# EAGLE design control_wdm (EAGLE 7.4.0)
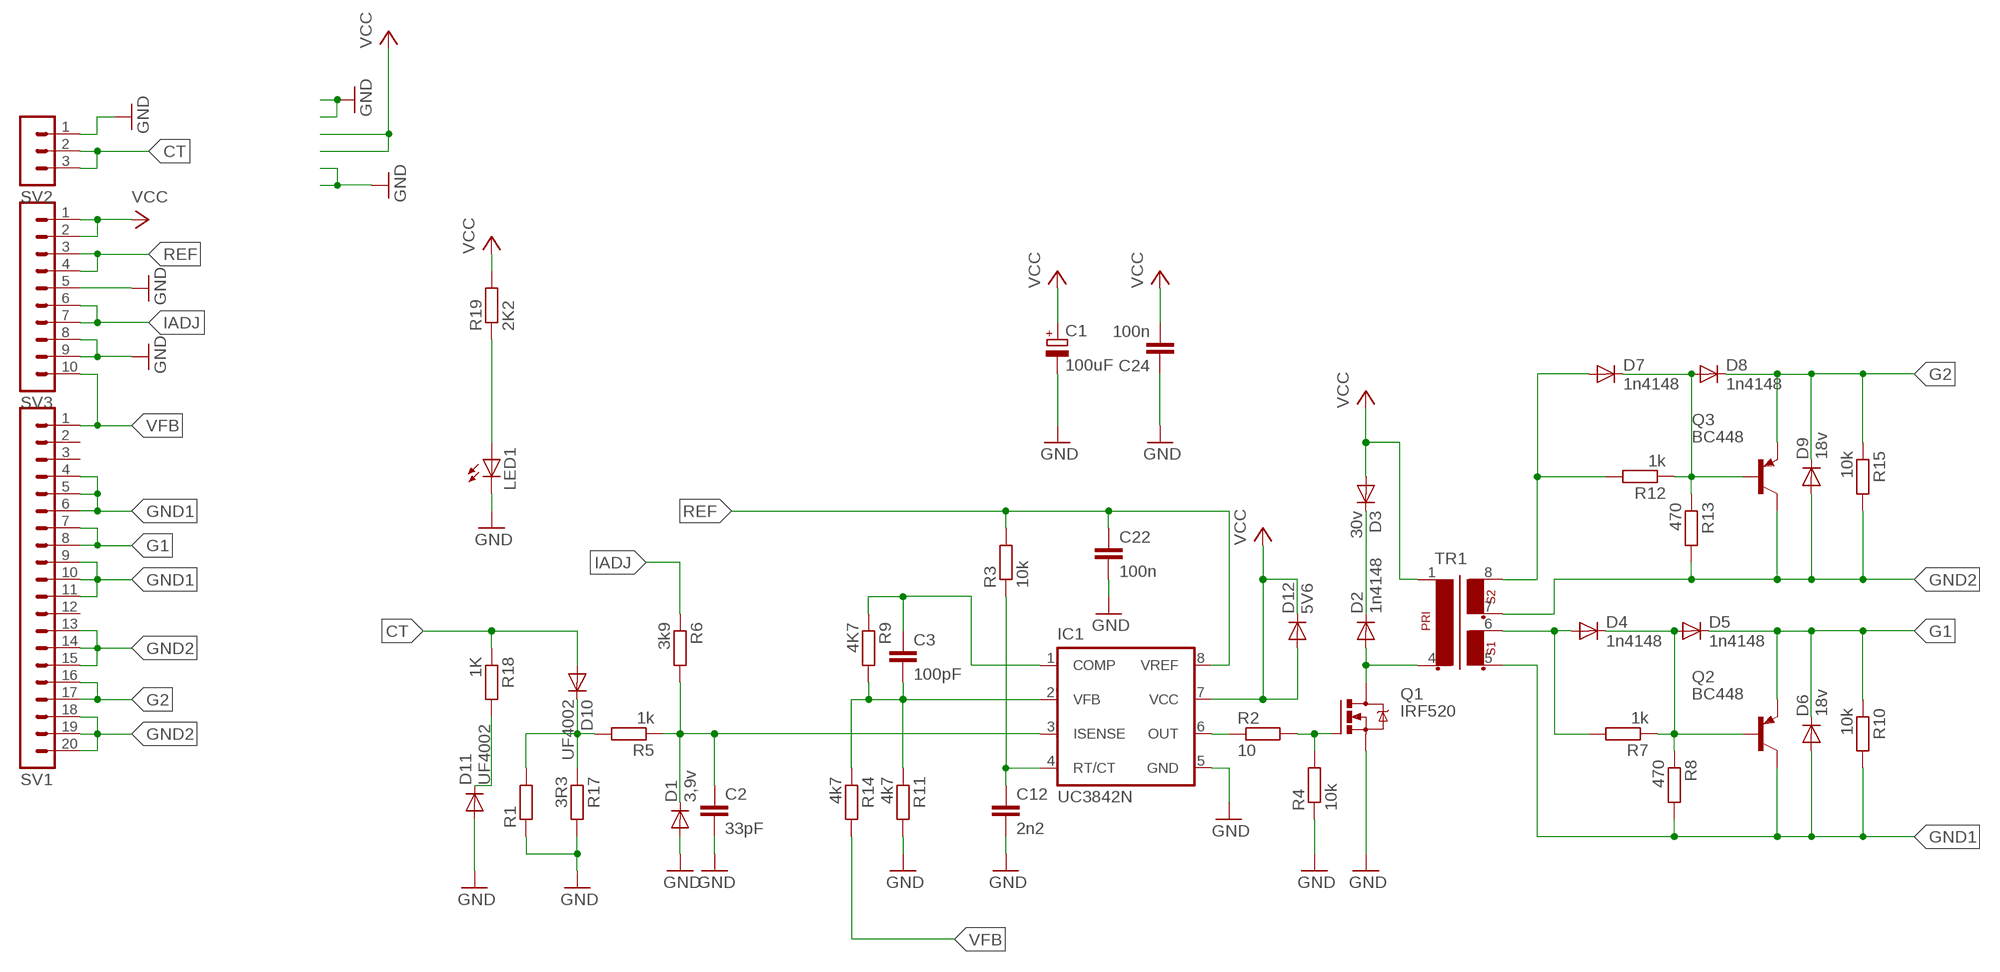
[diagram p0: schematic, sheet 1]

## Parts
C1  100uF  CPOL-EUE5-6  [E5-6]
C2  33pF  C-EU050-025X075  [C050-025X075]
C3  100pF  C-EU050-025X075  [C050-025X075]
C12  2n2  C-EU050-025X075  [C050-025X075]
C22  100n  C-EU050-025X075  [C050-025X075]
C24  100n  C-EU050-025X075  [C050-025X075]
D1  3,9v  1N4446  [DO35-10]
D2  1n4148  1N4446  [DO35-10]
D3  30v  1N4446  [DO35-10]
D4  1n4148  1N4446  [DO35-10]
D5  1n4148  1N4446  [DO35-10]
D6  18v  1N4446  [DO35-10]
D7  1n4148  1N4446  [DO35-10]
D8  1n4148  1N4446  [DO35-10]
D9  18v  1N4446  [DO35-10]
D10  UF4002  1N4446  [DO35-10]
D11  UF4002  1N4446  [DO35-10]
D12  5V6  1N4446  [DO35-10]
IC1  UC3842N  [DIL08]
LED1  LED5MM  [LED5MM]
Q1  IRF520  [TO220BV]
Q2  BC448  [TO92-EBC]
Q3  BC448  [TO92-EBC]
R1  R-EU_0411/12  [0411/12]
R2  10  R-EU_0207/10  [0207/10]
R3  10k  R-EU_0207/10  [0207/10]
R4  10k  R-EU_0207/10  [0207/10]
R5  1k  R-EU_0207/10  [0207/10]
R6  3k9  R-EU_0207/10  [0207/10]
R7  1k  R-EU_0207/10  [0207/10]
R8  470  R-EU_0207/10  [0207/10]
R9  4K7  R-EU_0207/10  [0207/10]
R10  10k  R-EU_0207/10  [0207/10]
R11  4k7  R-EU_0207/10  [0207/10]
R12  1k  R-EU_0207/10  [0207/10]
R13  470  R-EU_0207/10  [0207/10]
R14  4k7  R-EU_0207/10  [0207/10]
R15  10k  R-EU_0207/10  [0207/10]
R17  3R3  R-EU_0207/10  [0207/10]
R18  1K  R-EU_0207/10  [0207/10]
R19  2K2  R-EU_0207/10  [0207/10]
SV1  MA20-1  [MA20-1]
SV2  MA03-1  [MA03-1]
SV3  MA10-1  [MA10-1]
TR1  EE20-2  [EE20-2]

## Nets
CT: D10.A R18.1 SV2.2 SV2.3
G1: D5.C D6.C Q2.E R10.1 SV1.7 SV1.8
G2: D8.C D9.C Q3.E R15.1 SV1.16 SV1.17
GND: C1.- C2.2 C12.2 C22.2 C24.1 D1.A D11.A IC1.5(GND) LED1.K(C) Q1.S R1.1 R4.1 R11.2 R17.2 SV2.1 SV3.5 SV3.8 SV3.9
GND1: D6.A Q2.C R8.2 R10.2 SV1.4 SV1.5 SV1.6 SV1.9 SV1.10 SV1.11 TR1.5
GND2: D9.A Q3.C R13.2 R15.2 SV1.13 SV1.14 SV1.15 SV1.18 SV1.19 SV1.20 TR1.7
IADJ: R6.1 SV3.6 SV3.7
N$2: C12.1 IC1.4(RT/CT) R3.1
N$3: IC1.6(OUT) R2.1
N$4: Q1.G R2.2 R4.2
N$5: C2.1 D1.C IC1.3(ISENSE) R5.1 R6.2
N$6: D2.A Q1.D TR1.4
N$8: D2.C D3.C
N$9: LED1.A R19.1
N$10: C3.1 IC1.1(COMP) R9.1
N$11: D4.C D5.A Q2.B R7.1 R8.1
N$12: D4.A R7.2 TR1.6
N$13: D11.C R18.2
N$14: C3.2 IC1.2(VFB) R9.2 R11.1 R14.1
N$17: D7.C D8.A Q3.B R12.1 R13.1
N$18: D7.A R12.2 TR1.8
N$22: D10.C R1.2 R5.2 R17.1
REF: C22.1 IC1.8(VREF) R3.2 SV3.3 SV3.4
VCC: C1.+ C24.2 D3.A D12.A D12.C IC1.7(VCC) R19.2 SV3.1 SV3.2 TR1.1
VFB: R14.2 SV1.1 SV3.10
Unconnected: SV1.2 SV1.3 SV1.12

## Library data of the parts
C1 = rcl:CPOL-EU: POLARIZED CAPACITOR, European symbol
C2 C3 C12 C22 C24 = rcl:C-EU: CAPACITOR, European symbol
D1-D12 = diode:1N4446: DIODE high speed (Philips)
IC1 = v-reg:UC384*: SMPS Controller Source: http://www.fairchildsemi.com/ds/UC/UC3843.pdf
LED1 = led:LED: LED OSRAM: - CHIPLED LG R971, LG N971, LY N971, LG Q971, LY Q971, LO R971, LY R971 LH N974, LH R974 LS Q976, LO Q976, LY Q976 LO Q996 - Hyper CHIPLED LW Q18S LB Q993, LB Q99A, LB R99A - SideLED LS A670, LO A670, LY A670, LG A670, LP A670 LB A673, LV A673, LT A673, LW A673 LH A674 LY A675 LS A676, LA A676, LO A676, LY A676, LW A676 LS A679, LY A679, LG A679 - Hyper Micro SIDELED® LS Y876, LA Y876, LO Y876, LY Y876 LT Y87S - SmartLED LW L88C, LW L88S LB L89C, LB L89S, LG L890 LS L89K, LO L89K, LY L89K LS L896, LA L896, LO L896, LY L896 - TOPLED LS T670, LO T670, LY T670, LG T670, LP T670 LSG T670, LSP T670, LSY T670, LOP T670, LYG T670 LG T671, LOG T671, LSG T671 LB T673, LV T673, LT T673, LW T673 LH T674 LS T676, LA T676, LO T676, LY T676, LB T676, LH T676, LSB T676, LW T676 LB T67C, LV T67C, LT T67C, LS T67K, LO T67K, LY T67K, LW E67C LS E67B, LA E67B, LO E67B, LY E67B, LB E67C, LV E67C, LT E67C LW T67C LS T679, LY T679, LG T679 LS T770, LO T770, LY T770, LG T770, LP T770 LB T773, LV T773, LT T773, LW T773 LH T774 LS E675, LA E675, LY E675, LS T675 LS T776, LA T776, LO T776, LY T776, LB T776 LHGB T686 LT T68C, LB T68C - Hyper Mini TOPLED® LB M676 - Mini TOPLED Santana® LG M470 LS M47K, LO M47K, LY M47K Source: http://www.osram.convergy.de LUXEON: - LUMILED® LXK2-PW12-R00, LXK2-PW12-S00, LXK2-PW14-U00, LXK2-PW14-V00 LXK2-PM12-R00, LXK2-PM12-S00, LXK2-PM14-U00 LXK2-PE12-Q00, LXK2-PE12-R00, LXK2-PE12-S00, LXK2-PE14-T00, LXK2-PE14-U00 LXK2-PB12-K00, LXK2-PB12-L00, LXK2-PB12-M00, LXK2-PB14-N00, LXK2-PB14-P00, LXK2-PB14-Q00 LXK2-PR12-L00, LXK2-PR12-M00, LXK2-PR14-Q00, LXK2-PR14-R00 LXK2-PD12-Q00, LXK2-PD12-R00, LXK2-PD12-S00 LXK2-PH12-R00, LXK2-PH12-S00 LXK2-PL12-P00, LXK2-PL12-Q00, LXK2-PL12-R00 Source: www.luxeon.com KINGBRIGHT: KA-3528ASYC Source: www.kingbright.com
Q1 = transistor-power:IRF520: HEXFET Power MOSFET
Q2 Q3 = transistor-pnp:BC448*: PNP Transistror
R1-R15 R17-R19 = rcl:R-EU_: RESISTOR, European symbol
SV1 = con-lstb:MA20-1: PIN HEADER; OC_FARNELL: unknown; OC_NEWARK: unknown
SV2 = con-lstb:MA03-1: PIN HEADER; OC_FARNELL: unknown; OC_NEWARK: unknown
SV3 = con-lstb:MA10-1: PIN HEADER; OC_FARNELL: unknown; OC_NEWARK: unknown
TR1 = trafo:EE20-2: TRANSFORMER 1 primary winding, 2 secondary windings ERA

## Board
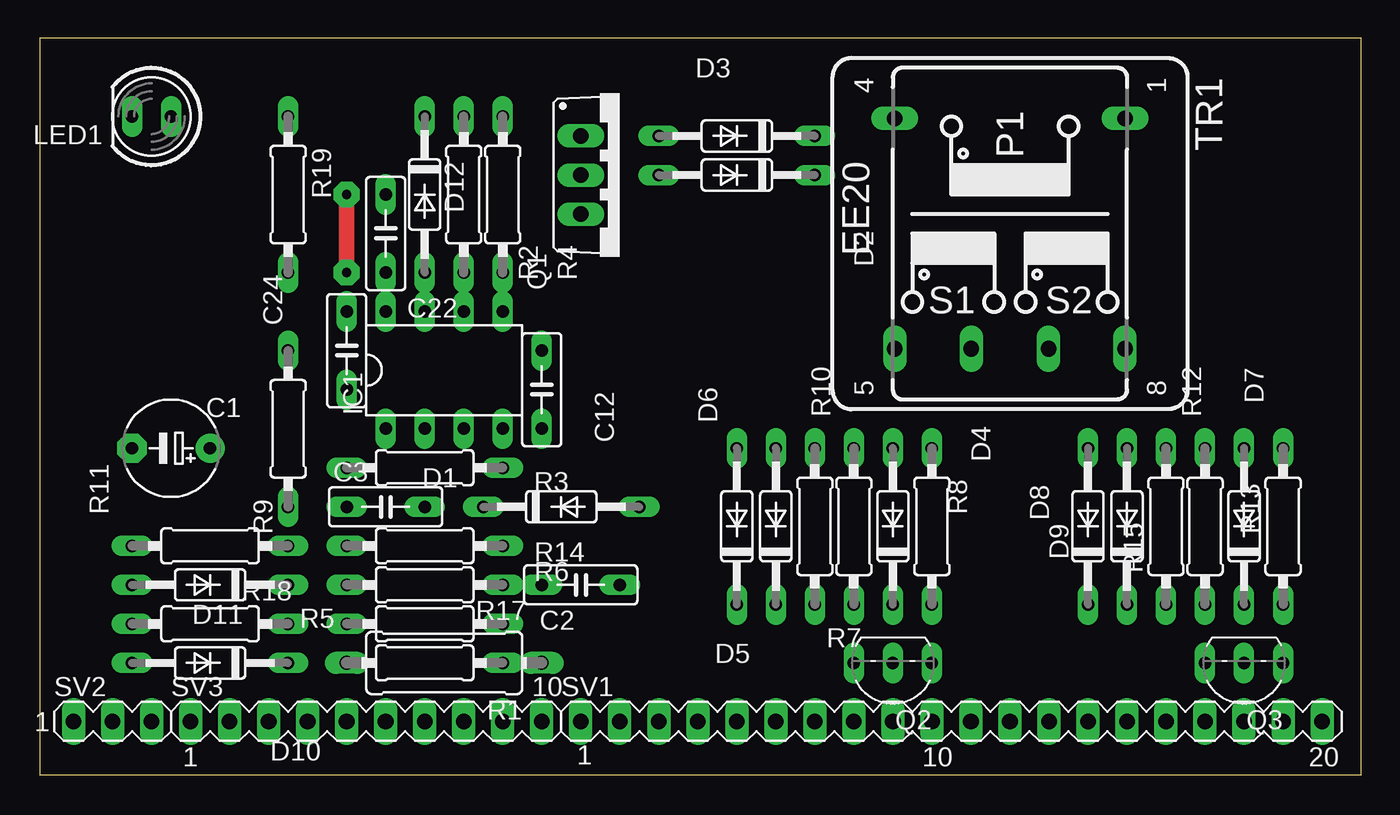
[diagram p1: board, top side]
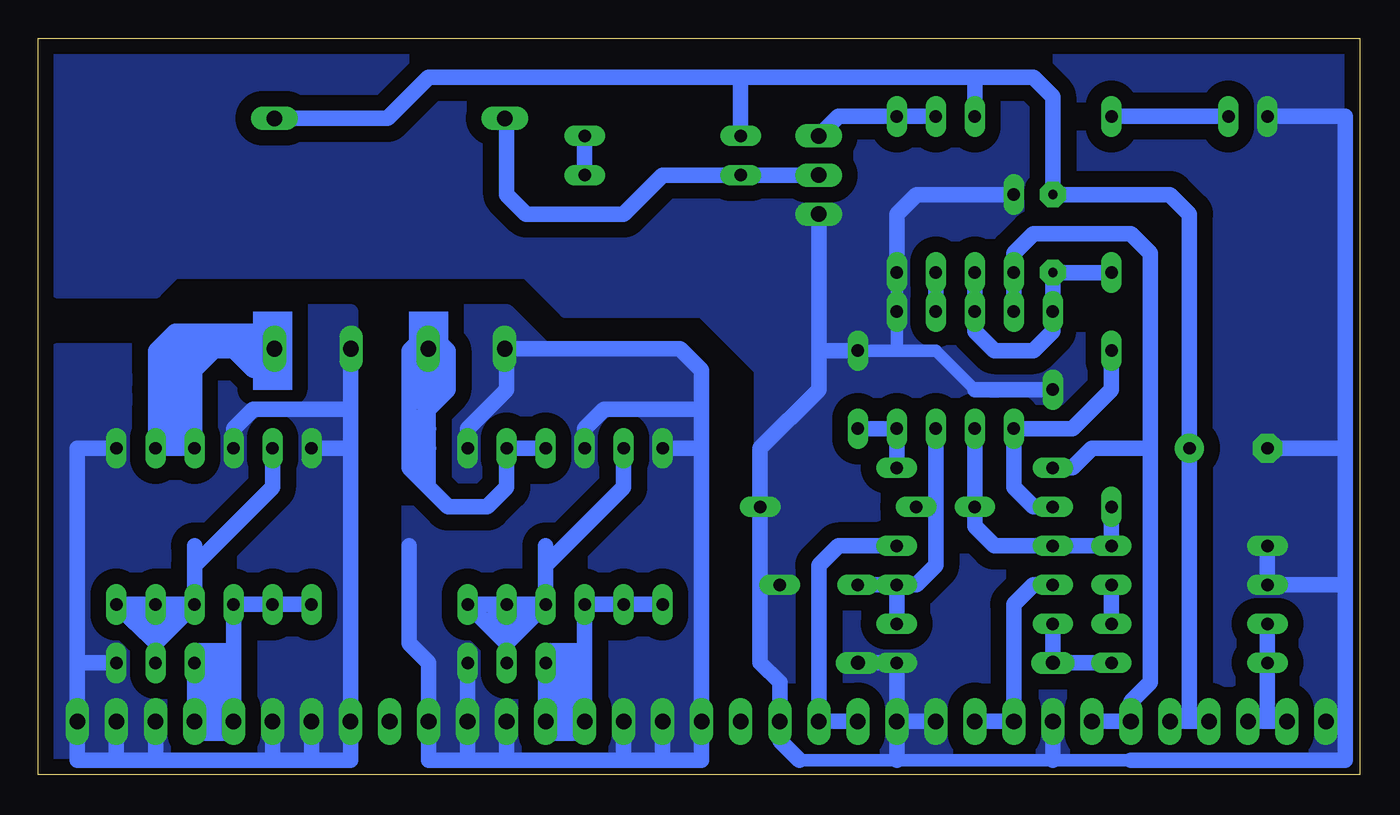
[diagram p2: board, bottom side, seen from below]

Size 86.03 x 47.93 mm. Coordinates in mm from the lower left corner, seen from the top.
Outline: 86.03,47.93 0,47.93 0,0 86.03,0 86.03,47.93
Copper layers (1*16): Top 0.035mm / dielectric 1.5mm / Bottom 0.035mm
Design rules "default": minimum track width 10mil, minimum drill 24mil, track to track 8mil, track to pad 8mil, pad to pad 8mil, via to via 8mil, smd to smd 8mil, copper to edge 40mil, drill to drill 8mil, minimum pad ring 10mil, minimum via ring 8mil, stop-mask expansion 4mil, vias tented up to drill 0mil, thermal gap 10mil

### Footprints (pad centres in the part's own frame; a part is rotated, then mirrored left to right if it is on the bottom)
E5-6 = drill 0.813 pad 1.905: + -2.54,0 | drill 0.813 pad 1.905 octagon: - 2.54,0
C050-025X075 = drill 0.813 long: 1 -2.54,0; 2 2.54,0
DO35-10 = drill 0.813 long: A 5.08,0; C -5.08,0
DIL08 = drill 0.813 long: 1 -3.81,-3.81; 2 -1.27,-3.81; 3 1.27,-3.81; 4 3.81,-3.81; 5 3.81,3.81; 6 1.27,3.81; 7 -1.27,3.81; 8 -3.81,3.81
LED5MM = drill 0.813 long: A -1.27,0; K 1.27,0
TO220BV = drill 1.016 long: D 0,-2.54; G -2.54,-2.54; S 2.54,-2.54
TO92-EBC = drill 0.813 long: B 0,-1.27; C -2.54,-1.27; E 2.54,-1.27
0411/12 = drill 0.914 long: 1 -6.35,0; 2 6.35,0
0207/10 = drill 0.813 long: 1 -5.08,0; 2 5.08,0
MA20-1 = drill 1.016 long: 1 -24.13,0; 2 -21.59,0; 3 -19.05,0; 4 -16.51,0; 5 -13.97,0; 6 -11.43,0; 7 -8.89,0; 8 -6.35,0; 9 -3.81,0; 10 -1.27,0; 11 1.27,0; 12 3.81,0; 13 6.35,0; 14 8.89,0; 15 11.43,0; 16 13.97,0; 17 16.51,0; 18 19.05,0; 19 21.59,0; 20 24.13,0
MA03-1 = drill 1.016 long: 1 -2.54,0; 2 0,0; 3 2.54,0
MA10-1 = drill 1.016 long: 1 -11.43,0; 2 -8.89,0; 3 -6.35,0; 4 -3.81,0; 5 -1.27,0; 6 1.27,0; 7 3.81,0; 8 6.35,0; 9 8.89,0; 10 11.43,0
EE20-2 = drill 1.016 long: 1 -7.493,7.493; 4 -7.493,-7.493; 5 7.493,-7.493; 6 7.493,-2.515; 7 7.493,2.515; 8 7.493,7.493

### Placement (x,y rotation side)
C1  8.56,21.26 180 top
C2  35.23,12.37 0 top
C3  22.53,17.45 0 top
C12  32.69,25.07 90 top
C22  22.53,35.23 90 top
C24  19.99,27.61 90 top
D1  33.96,17.45 0 top
D2  45.39,39.04 180 top
D3  45.39,41.58 180 top
D4  55.55,16.18 90 top
D5  47.93,16.18 90 top
D6  45.39,16.18 90 top
D7  78.41,16.18 90 top
D8  70.79,16.18 90 top
D9  68.25,16.18 90 top
D10  11.1,7.29 180 top
D11  11.1,12.37 180 top
D12  25.07,37.77 270 top
IC1  26.34,26.34 0 top
LED1  7.29,42.85 180 top
Q1  37.77,39.04 270 top
Q2  55.55,6.02 180 top
Q3  78.41,6.02 180 top
R1  26.34,7.29 180 top
R2  27.61,37.77 90 top
R3  25.07,19.99 180 top
R4  30.15,37.77 90 top
R5  25.07,9.83 180 top
R6  25.07,12.37 0 top
R7  53.01,16.18 90 top
R8  58.09,16.18 90 top
R9  16.18,22.53 270 top
R10  50.47,16.18 90 top
R11  11.1,14.91 180 top
R12  75.87,16.18 90 top
R13  80.95,16.18 90 top
R14  25.07,14.91 0 top
R15  73.33,16.18 90 top
R17  25.07,7.29 0 top
R18  11.1,9.83 0 top
R19  16.18,37.77 270 top
SV1  59.36,3.48 0 top
SV2  4.75,3.48 0 top
SV3  21.26,3.48 0 top
TR1  63.17,35.23 270 top

### Tracks (layer width: path | path; a pad name or v marks a point on that pad's centre or on a via)
CT
  Bottom 1.016: R18.1 D10.A 6.02,3.48 | 6.02,3.48 SV2.2 | SV2.3 6.02,3.48
G1
  Bottom 1.016: D6.C D5.C R10.1 50.47,7.29 | 50.47,7.29 SV1.7 | 50.47,7.29 Q2.E SV1.8
G2
  Bottom 1.016: D9.C D8.C R15.1 SV1.16 SV1.17 Q3.E
GND
  Bottom 0.813: 25.07,25.07 27.61,27.61 30.15,27.61 | 14.91,0.94 19.99,0.94 30.15,0.94 36.5,0.94 | 30.15,27.61 IC1.5 R4.1 | C12.2 30.15,27.61
  Bottom 1.016: R4.1 30.15,36.5 28.88,37.77 C22.2 | 36.5,0.94 37.77,2.21 37.77,6.02 39.04,7.29 39.04,12.37 | 39.04,12.37 D1.A 39.04,21.26 35.23,25.07 35.23,27.61 | C2.2 39.04,12.37 | Q1.S 35.23,27.61 | C12.2 35.23,27.61 | C24.1 25.07,25.07 | SV3.9 R17.2 R1.1 | R11.2 D11.A 0.94,12.37 | LED1.K 0.94,42.85 0.94,21.26 | 0.94,21.26 0.94,12.37 | 0.94,12.37 0.94,3.48 | 0.94,3.48 0.94,0.94 14.91,0.94 | C1.- 0.94,21.26 | SV2.1 0.94,3.48 | SV3.5 19.99,0.94 | SV3.9 30.15,0.94 | SV3.8 SV3.9
  pour Bottom (isolate 1.016, no thermals): -0.33,0.94 36.5,0.94 37.77,2.21 37.77,6.02 39.04,7.29 39.04,26.34 42.85,30.15 51.74,30.15 54.28,32.69 77.14,32.69 78.41,31.42 84.76,31.42 86.03,32.69 86.03,47.93 -0.33,47.93
GND1
  Bottom 1.016: 61.9,14.91 61.9,8.56 60.63,7.29 SV1.11 60.63,0.94 58.09,0.94 | 42.85,23.8 42.85,26.34 44.25,27.74 TR1.5 55.55,27.61 55.55,25.07 58.09,22.53 R8.2 | 42.85,23.8 42.85,21.26 | 42.85,21.26 SV1.4 42.85,0.94 45.39,0.94 | 45.39,0.94 47.93,0.94 | 58.09,0.94 55.55,0.94 | 55.55,0.94 47.93,0.94 | Q2.C SV1.10 58.09,0.94 | R10.2 50.47,22.53 49.2,23.8 42.85,23.8 | D6.A 42.85,21.26 | SV1.6 47.93,0.94 | SV1.5 45.39,0.94 | SV1.9 55.55,0.94
  pour Bottom (isolate 1.016, no thermals): 60.63,0.94 60.63,7.29 61.9,8.56 61.9,30.15 55.55,30.15 53.01,27.61 44.12,27.61 42.85,26.34 42.85,0.94
GND2
  Bottom 1.016: D9.A 65.71,21.26 | 65.71,21.26 SV1.13 65.71,0.94 68.25,0.94 | 70.79,0.94 68.25,0.94 | 83.49,7.29 SV1.20 83.49,0.94 80.95,0.94 | 80.95,0.94 78.41,0.94 | 78.41,0.94 70.79,0.94 | 65.71,21.26 65.71,23.8 | 65.71,23.8 65.71,27.71 TR1.7 | Q3.C 83.49,7.29 | R13.2 83.49,21.26 83.49,7.29 | R15.2 73.33,22.53 72.06,23.8 65.71,23.8 | SV1.15 70.79,0.94 | SV1.14 68.25,0.94 | SV1.18 78.41,0.94 | SV1.19 80.95,0.94
  pour Bottom (isolate 1.016, no thermals): 84.76,0.94 84.76,27.61 78.41,27.61 75.87,30.15 65.71,30.15 65.71,0.94
IADJ
  Bottom 1.016: R6.1 21.26,12.37 22.53,11.1 SV3.6 SV3.7
N$2
  Bottom 1.016: C12.1 IC1.4 R3.1
N$3
  Bottom 1.016: R2.1 IC1.6
N$4
  Bottom 1.016: R2.2 R4.2 33.96,42.85 Q1.G
N$5
  Bottom 1.016: IC1.3 27.61,17.45 | 27.61,17.45 27.61,13.64 28.88,12.37 R6.2 | D1.C 27.61,17.45 | R5.1 R6.2 | R6.2 C2.1
N$6
  Bottom 1.016: 55.55,42.85 TR1.4 55.55,42.6 55.55,37.77 54.28,36.5 47.93,36.5 45.39,39.04 D2.A Q1.D
N$8
  Bottom 1.016: D3.C D2.C
N$9
  Bottom 1.016: LED1.A R19.1
N$10
  Bottom 1.016: R9.1 16.18,25.07 18.72,22.53 IC1.1 22.53,18.72 21.26,17.45 C3.1
N$11
  Bottom 1.016: 55.55,8.56 55.55,9.83 | 55.55,9.83 D4.C | 53.01,14.91 53.01,13.64 | 53.01,13.64 R7.1 | Q2.B 55.55,8.56 | 55.55,8.56 56.82,9.83 | 56.82,9.83 R8.1 D4.C | D4.C 54.28,11.1 | 54.28,11.1 R7.1 | R7.1 54.28,9.83 | 54.28,9.83 55.55,8.56 | 56.82,9.83 D4.C | D4.C 54.28,9.83 | 54.28,9.83 54.28,11.1 | 55.55,9.83 54.28,9.83 | 55.55,9.83 56.82,9.83 | D5.A 47.93,18.72 53.01,13.64
N$12
  Bottom 1.016: R7.2 D4.A 55.55,18.72 56.82,17.45 59.36,17.45 60.66,18.75 | TR1.6 60.66,18.75 | 60.66,18.75 61.9,19.99 | 61.9,19.99 61.9,21.26 | 61.9,21.26 61.9,22.53 | 61.9,22.53 61.9,25.07 | 61.9,25.07 61.9,27.61 60.63,28.88 59.36,27.61 59.36,25.07 | 59.36,25.07 60.63,23.8 | 60.63,23.8 61.9,25.07 | 61.9,25.07 59.36,25.07 | 60.63,23.8 61.9,22.53 | 61.9,22.53 60.63,22.53 61.9,21.26 | 61.9,21.26 60.63,21.26 61.9,19.99
N$13
  Bottom 1.016: D11.C R18.2
N$14
  Bottom 1.016: R9.2 R11.1 R14.1 23.8,14.91 25.07,16.18 C3.2 IC1.2
N$17
  Bottom 1.016: 78.41,8.56 D7.C | 75.87,14.91 75.87,13.64 | 75.87,13.64 R12.1 | Q3.B 78.41,8.56 | 78.41,8.56 79.68,9.83 | 79.68,9.83 R13.1 79.68,11.1 | 79.68,11.1 D7.C | 77.14,11.1 R12.1 | R12.1 77.14,9.83 | 78.41,8.56 77.14,9.83 | 77.14,9.83 D7.C | D7.C 79.68,9.83 | 79.68,9.83 77.14,9.83 | 77.14,9.83 77.14,11.1 | 77.14,11.1 D7.C | 79.68,11.1 79.68,9.83 | D8.A 70.79,18.72 75.87,13.64
N$18
  Bottom 1.016: TR1.8 74.47,27.74 | 74.47,27.74 74.6,27.61 | 74.6,27.61 75.87,26.34 | D7.A 78.41,23.8 | 78.41,26.34 78.41,27.61 77.14,28.88 75.87,28.88 | 72.06,28.88 70.79,28.88 70.79,26.34 72.06,26.34 | 72.06,26.34 73.33,27.61 | 73.33,27.61 72.06,27.61 | 72.06,27.61 72.06,26.34 | 72.06,27.61 72.06,28.88 | 73.33,28.88 74.6,28.88 | 74.6,28.88 75.87,28.88 | 75.87,28.88 77.14,27.61 | 77.14,27.61 75.87,27.61 | 75.87,27.61 74.6,27.61 | 74.6,27.61 73.33,27.61 | 73.33,27.61 72.06,28.88 | 72.06,28.88 73.33,28.88 | 73.33,28.88 74.47,27.74 | 74.6,27.61 74.6,28.88 | 74.6,28.88 75.87,27.61 | 75.87,27.61 77.14,26.34 | 77.14,26.34 77.14,23.8 | 77.14,23.8 77.14,22.53 | 77.14,22.53 77.14,21.26 | 77.14,21.26 R12.2 75.87,22.53 | 75.87,22.53 75.87,23.8 | 75.87,25.07 75.87,26.34 | 77.14,27.61 75.87,26.34 | 75.87,26.34 77.14,26.34 | 77.14,26.34 78.41,26.34 | 78.41,26.34 78.41,25.07 | 78.41,25.07 77.14,25.07 75.87,26.34 | 77.14,27.61 78.41,26.34 | 78.41,26.34 75.87,23.8 | 75.87,23.8 77.14,23.8 | 77.14,23.8 78.41,25.07 | 78.41,25.07 78.41,23.8 | 78.41,23.8 77.14,22.53 | D7.A 77.14,21.26 | 77.14,21.26 75.87,22.53 | 75.87,22.53 77.14,22.53 | 77.14,22.53 D7.A | D7.A 78.41,22.53 77.14,23.8 | 77.14,23.8 75.87,22.53 | 75.87,23.8 75.87,25.07 | 75.87,25.07 77.14,26.34
N$22
  Bottom 1.016: R5.2 R1.2 D10.C
REF
  Bottom 1.016: IC1.8 C22.1 22.53,33.96 21.26,35.23 14.91,35.23 13.64,33.96 13.64,21.26 | 13.64,21.26 13.64,6.02 14.91,4.75 SV3.3 SV3.4 | R3.2 18.72,19.99 17.45,21.26 13.64,21.26
VCC  (via drill 0.6 pad 1.68)
  Top 1.016: v19.99,32.69 v19.99,37.77
  Bottom 1.016: 40.31,45.39 60.63,45.39 63.3,42.72 TR1.1 | 40.31,45.39 25.07,45.39 | 25.07,45.39 21.26,45.39 19.99,44.12 v19.99,37.77 12.37,37.77 11.1,36.5 C1.+ 11.1,3.48 SV3.1 SV3.2 | D12.A IC1.7 25.07,28.88 23.8,27.61 21.26,27.61 19.99,28.88 C24.2 v19.99,32.69 R19.2 | D3.A 40.31,45.39 | D12.C 25.07,45.39
VFB
  Bottom 1.016: R14.2 33.96,14.91 35.23,13.64 SV1.1 SV3.10
(copper drawn outside any net)
  shapes: Bottom area x6